# Altium project H7864.PrjPcb
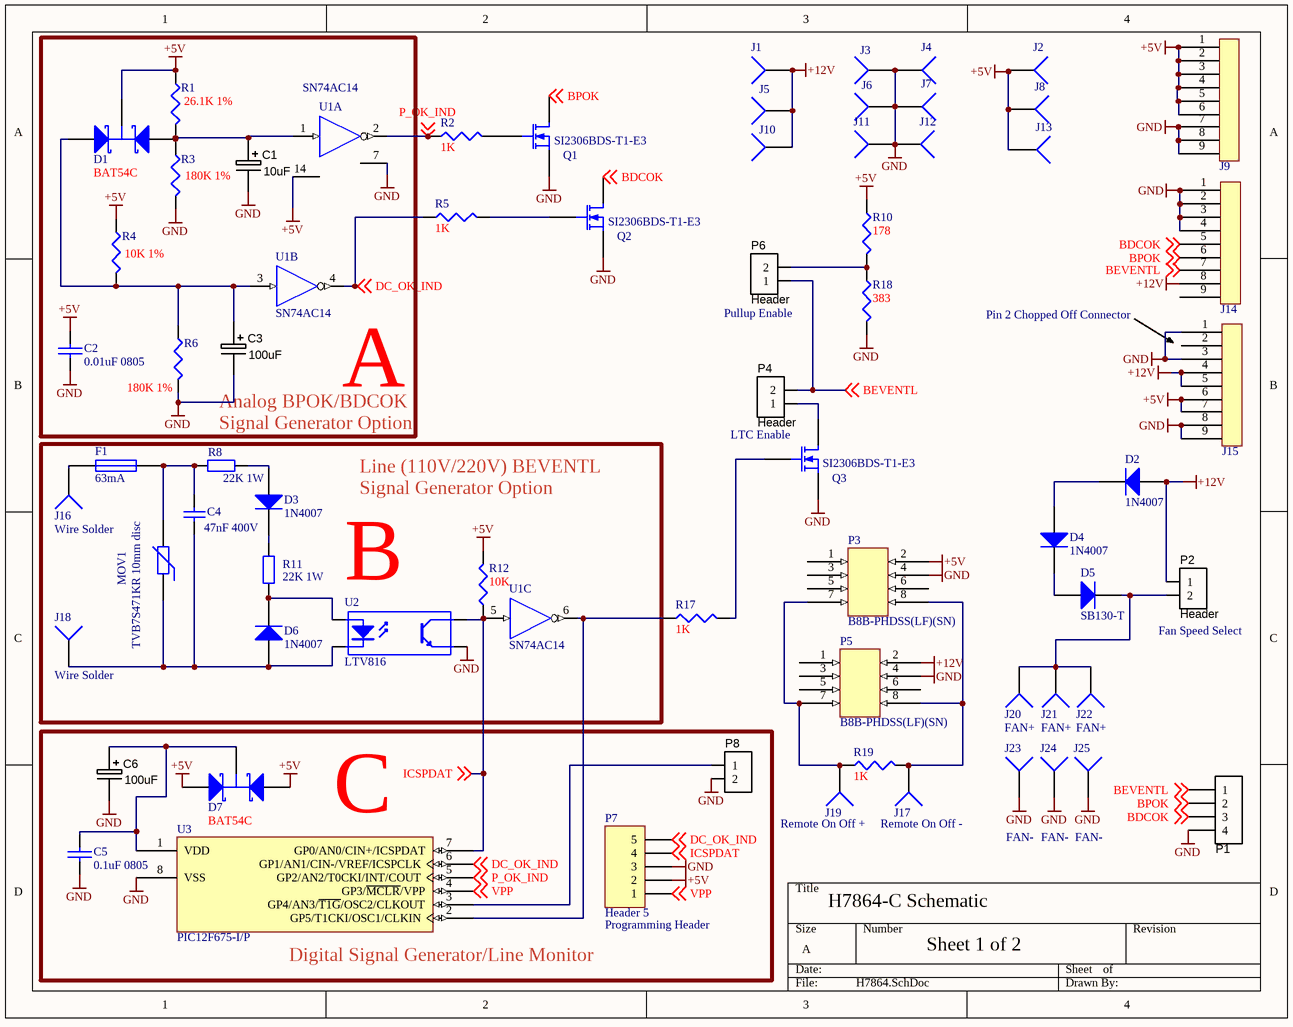
[diagram p0: H7864.SchDoc]
2 sheets, 77 parts. Net scope: global (net labels, ports and power ports of the same name join across sheets).
Board file: H7864-B-1.pcbdoc
Sheets:
  H7864.SchDoc
  Indicators.SchDoc

## Sheet H7864.SchDoc
size A

### Parts
C1  10uF  [CAPMP3216X180N]
C2  value 0.01uF 0805  [C0805-S]  (hidden comment: VJ0805Y103JXAPW1BC)
C3  100uF  [CAPMP3216X180N]
C4  value 47nF 400V  [MKP-3381-15]
C5  value 0.1uF 0805  [C0805-S]  (hidden comment: VJ0805Y103JXAPW1BC)
C6  100uF  [CAPMP3216X180N]
D1  BAT54C  [SOT23]
D2  value 1N4007  [DO-204AL]
D3  value 1N4007  [DO-204AL]
D4  value 1N4007  [DO-204AL]
D5  value SB130-T  [DO-204AL]
D6  value 1N4007  [DO-204AL]
D7  BAT54C  [SOT23]
F1  63mA  [FUSE HOLDER 656]
J1  Wire Solder  [TP-THT-MULTI]  (value not drawn)  (no BOM)
J2  Wire Solder  [TP-THT-MULTI]  (value not drawn)  (no BOM)
J3  Wire Solder  [TP-THT-MULTI]  (value not drawn)  (no BOM)
J4  Wire Solder  [TP-THT-MULTI]  (value not drawn)  (no BOM)
J5  Wire Solder  [TP-THT-MULTI]  (value not drawn)  (no BOM)
J6  Wire Solder  [TP-THT-MULTI]  (value not drawn)  (no BOM)
J7  Wire Solder  [TP-THT-MULTI]  (value not drawn)  (no BOM)
J8  Wire Solder  [TP-THT-MULTI]  (value not drawn)  (no BOM)
J9  1-640385-9  [MTA156-9]  (value not drawn)
J10  Wire Solder  [TP-THT-MULTI]  (value not drawn)  (no BOM)
J11  Wire Solder  [TP-THT-MULTI]  (value not drawn)  (no BOM)
J12  Wire Solder  [TP-THT-MULTI]  (value not drawn)  (no BOM)
J13  Wire Solder  [TP-THT-MULTI]  (value not drawn)  (no BOM)
J14  1-640385-9  [MTA156-9]  (value not drawn)
J15  1-640385-9  [MTA156-9]  (value not drawn)
J16  Wire Solder  [TP-THT-MULTI]
J17  Remote On Off -  [TP-THT-MULTI]
J18  Wire Solder  [TP-THT-MULTI]
J19  Remote On Off +  [TP-THT-MULTI]
J20  FAN+  [TP-THT-MULTI]  (no BOM)
J21  FAN+  [TP-THT-MULTI]  (no BOM)
J22  FAN+  [TP-THT-MULTI]  (no BOM)
J23  FAN-  [TP-THT-MULTI]  (no BOM)
J24  FAN-  [TP-THT-MULTI]  (no BOM)
J25  FAN-  [TP-THT-MULTI]  (no BOM)
MOV1  TVB7S471KR 10mm disc  [TVR1010]
P1  Programmer  [HDR1X4_2.54mmp]  (value not drawn)  (no BOM)
P2  Header  [HDR_1x2_Offset]
P3  B8B-PHDSS(LF)(SN)  [B8B-PHDSS]
P4  Header  [HDR_1x2_Offset]
P5  B8B-PHDSS(LF)(SN)  [B8B-PHDSS]
P6  Header  [HDR_1x2_Offset]
P7  Header 5  [HDR1X5]  (no BOM)
P8  Header  [HDR_1x2_Offset]  (value not drawn)
Q1  SI2306BDS-T1-E3  [SOT23-3]
Q2  SI2306BDS-T1-E3  [SOT23-3]
Q3  SI2306BDS-T1-E3  [SOT23-3]
R1  26.1K 1%  [2012[0805]]
R2  value 1K  [2012[0805]]  (hidden comment: CRCW080547K0FKEA)
R3  180K 1%  [2012[0805]]
R4  value 10K 1%  [2012[0805]]
R5  value 1K  [2012[0805]]  (hidden comment: CRCW080547K0FKEA)
R6  180K 1%  [2012[0805]]
R8  value 22K 1W  [RESTH_AXIAL_MRA-05]
R10  value 178  [2012[0805]]  (hidden comment: CRCW080547K0FKEA)
R11  value 22K 1W  [RESTH_AXIAL_MRA-05]
R12  value 10K  [2012[0805]]  (hidden comment: CRCW080547K0FKEA)
R17  value 1K  [2012[0805]]  (hidden comment: CRCW080547K0FKEA)
R18  value 383  [2012[0805]]  (hidden comment: CRCW080547K0FKEA)
R19  value 1K  [2012[0805]]  (hidden comment: CRCW080547K0FKEA)
U1  SN74AC14  [J014C]  (parts A,B,C of 6)
U2  LTV816  [DIP-4]
U3  PIC12F675-I/P  [DIP8-300]

### Blocks framed on the sheet
Programming Header: C5 C6 D7 P7 P8 U3

### Nets
+5V: C2.2 D1.3(K) D7.1(A1) D7.2(A2) J2.1 J8.1 J9.1 J9.2 J9.3 J9.4 J9.5 J9.6 J13.1 J15.6 J15.7 P3.2 P7.2 R1.1 R4.1 R10.1 R12.2 U1.14(VCC)
+12V: D2.1(A) J1.1 J5.1 J10.1 J14.8 J15.4 J15.5 P2.1 P5.2
GND: C1.2 C2.1 C3.2 C5.1 C6.2 J3.1 J4.1 J6.1 J7.1 J9.7 J9.8 J9.9 J11.1 J12.1 J14.1 J14.2 J14.3 J14.4 J15.1 J15.3 J15.8 J15.9 J23.1 J24.1 J25.1 P1.4 P3.4 P5.4 P7.3 P8.2 Q1.2(S) Q2.2(S) Q3.2(S) R3.2 R6.2 R18.2 U1.7(GND) U2.3(E) U3.8(VSS)
VCC: U1.14(VCC)
BDCOK: J14.5 P1.3 Q2.3(D) ; off-sheet BDCOK
BEVENTL: J14.7 P1.1 P4.2 P6.1 ; off-sheet BEVENTL
BPOK: J14.6 P1.2 Q1.3(D) ; off-sheet BPOK
DC_OK_IND: P7.5 R5.1 U1.4(Y) U3.6(GP1/AN1/CIN-/VREF/ICSPCLK) ; off-sheet DC_OK_IND
ICSPDAT: P7.4 R12.1 U1.5(A) U2.4(C) U3.7(GP0/AN0/CIN+/ICSPDAT) ; off-sheet ICSPDAT
P_OK_IND: R2.1 U1.2(Y) U3.5(GP2/AN2/T0CKI/INT/COUT) ; off-sheet P_OK_IND
VPP: P7.1 U3.4(GP3/~{MCLR}/VPP) ; off-sheet VPP
NetC1_1: C1.1 D1.2(A2) R1.2 R3.1 U1.1(A)
NetC3_1: C3.1 D1.1(A1) R4.2 R6.1 U1.3(A)
NetC4_1: C4.1 D6.1(A) J18.1 MOV1.1 U2.2(K)
NetC4_2: C4.2 F1.1 MOV1.2 R8.1
NetC5_2: C5.2 C6.1 D7.3(K) U3.1(VDD)
NetD2_2: D2.2(K) D4.1(A)
NetD3_1: D3.1(A) R8.2
NetD3_2: D3.2(K) R11.1
NetD4_2: D4.2(K) D5.1(A)
NetD5_2: D5.2(K) J20.1 J21.1 J22.1 P2.2
NetD6_2: D6.2(K) R11.2 U2.1(A)
NetF1_2: F1.2 J16.1
NetJ17_1: J17.1 P3.8 P5.8 R19.2
NetJ19_1: J19.1 P3.7 P5.7 R19.1
NetP4_1: P4.1 Q3.3(D)
NetP6_2: P6.2 R10.2 R18.1
NetP8_1: P8.1 U3.3(GP4/AN3/~{T1G}/OSC2/CLKOUT)
NetQ1_1: Q1.1(G) R2.2
NetQ2_1: Q2.1(G) R5.2
NetQ3_1: Q3.1(G) R17.2
NetR17_1: R17.1 U1.6(Y) U3.2(GP5/T1CKI/OSC1/CLKIN)

Not connected (* = marked no-connect by the designer): J14 9; J15 2; P3 1 3 5 6; P5 1 3 5 6

### Notes on the sheet
- (near P6) Pullup Enable
- Pin 2 Chopped Off Connector
- (near U1) A
- (near Q3) LTC Enable
- (near R8) Analog BPOK/BDCOK Signal Generator Option
- (near R12) Line (110V/220V) BEVENTL Signal Generator Option
- (near U2) B
- (near P2) Fan Speed Select
- (near U3) C
- H7864-C Schematic
- (near U3) Digital Signal Generator/Line Monitor
- Sheet 1 of 2

### Library data of the parts
C1 = CAPT_68u_3216_6V3: Capacitor SMD Tantalum 68uF 10% 6.3V EIA 3216-18; Manufacturer 1: Kemet; Manufacturer Part Number 1: T491A686K006AT; Manufacturer Size Code: A; Material: Solid Tantalum; ESR (Equivalent Series Resistance): 4.000 Ohm; SCDType: spec; P/N: TAJS106K006RNJ; Package / Case: 1206 (3216 Metric); Ratings: 6.3V; Tolerance: ±10%; Supplier 1: Digi-Key; Supplier Part Number 1: 399-4698-1-ND; Operating Temperature: -55°C ~ 125°C; Size / Dimension: 0.126" L x 0.063" W (3.20mm x 1.60mm); Height - Seated (Max): 0.071" (1.80mm); ComponentLink1URL: http://www.kemet.com/datasheets&T491A686K006AT; ComponentLink1Description: http://www.kemet.com/datasheets&T491A686K006AT; Value: 10uF
C2 = CAP: Capacitor; Manufacturer: Vishay; P/N: VJ0805Y103JXQPW1BC
C3 C6 = CAPT_68u_3216_6V3: Capacitor SMD Tantalum 68uF 10% 6.3V EIA 3216-18; Manufacturer 1: Kemet; Manufacturer Part Number 1: T491A686K006AT; Manufacturer Size Code: A; Material: Solid Tantalum; ESR (Equivalent Series Resistance): 4.000 Ohm; SCDType: spec; P/N: TCTAS0J107M8R; Package / Case: 1206 (3216 Metric); Ratings: 6.3V; Tolerance: ±10%; Supplier 1: Digi-Key; Supplier Part Number 1: 399-4698-1-ND; Operating Temperature: -55°C ~ 125°C; Size / Dimension: 0.126" L x 0.063" W (3.20mm x 1.60mm); Height - Seated (Max): 0.071" (1.80mm); ComponentLink1URL: http://www.kemet.com/datasheets&T491A686K006AT; ComponentLink1Description: http://www.kemet.com/datasheets&T491A686K006AT; Value: 100uF
C4 = Cap: Capacitor; P/N: B32642B6473J; Published: 8-Jun-2000; LatestRevisionDate: 17-Jul-2002; LatestRevisionNote: Re-released for DXP Platform.; PackageReference: RAD-0.3; Publisher: Altium Limited
C5 = CAP: Capacitor; Manufacturer: Vishay; P/N: VJ0805Y104KXQCW1BC
D1 D7 = BAT54C: Schottky Barrier Double Diode; Value: Dual Diode SOT23 Schottky; Published: 17-Sep-2003; LatestRevisionDate: 12-Dec-2006; LatestRevisionNote: IPC-7351 Footprint Added.; DatasheetVersion: 4-Mar-2002; PackageVersion: May-1999; PackageReference: SOT23; Publisher: Altium Limited; PackageDescription: 3-Pin SOT-23 Package 0.95 mm Pitch, 2.3 mm Lead Span; ComponentLink1Description: Manufacturer Link; ComponentLink1URL: http://www.semiconductors.philips.com/; ComponentLink2Description: Datasheet; ComponentLink2URL: http://www.semiconductors.philips.com/acrobat/datasheets/BAT54_SERIES_4.pdf; P/N: BAT54C
D2-D6 = Diode 1N4007: 1 Amp General Purpose Rectifier; Published: 8-Jun-2000; LatestRevisionDate: 17-Jul-2002; LatestRevisionNote: Re-released for DXP Platform.; DatasheetVersion: 1998; PackageVersion: Aug-1999; PackageReference: DO-41; Publisher: Altium Limited; PackageDescription: Diode, Axial; Body 5.2 x 2.7 mm (LxDia. max), Lead Dia. 0.86 mm (max); Code_JEDEC: DO-204-AL; ComponentLink1Description: Manufacturer Link; ComponentLink1URL: http://www.fairchildsemi.com/; ComponentLink2Description: Datasheet; ComponentLink2URL: http://www.fairchildsemi.com/ds/1N%2F1N4001.pdf
  D2-D4 D6: P/N: 1N4007
  D5: P/N: SB130-T
F1 = Fuse 1: Fuse Holder 65600001009  + cover 65900000009; Published: 8-Jun-2000; LatestRevisionDate: 17-Jul-2002; LatestRevisionNote: Re-released for DXP Platform.; PackageReference: PIN-W2/E2.8; Publisher: Altium Limited; P/N: 65600001009
J1-J8 J10-J13 J16-J18 J20-J25 = Socket: LatestRevisionDate: 17-Jul-2002; LatestRevisionNote: Re-released for DXP Platform.; Publisher: Altium Limited
J19 = Socket: P/N: 640388-2; LatestRevisionDate: 17-Jul-2002; LatestRevisionNote: Re-released for DXP Platform.; Publisher: Altium Limited
MOV1 = Res Varistor: Varistor (Voltage-Sensitive Resistor); Published: 24-Mar-1999; LatestRevisionDate: 29-May-2009; LatestRevisionNote: IPC-7351 Footprint Added.; PackageVersion: Mar-2003; PackageReference: 6-0805; Publisher: Altium Limited; PackageDescription: Chip Resistor 0805 Case Size; Code_IPC: RESC2012; P/N: TVB7S471KR
P1 = Header4P: Header 4-pin
P2 P4 P6 P8 = Header2P: Header, 2-pin; P/N: 61300211121
P7 = Header 5: Header, 5-Pin; LatestRevisionDate: 17-Jul-2002; LatestRevisionNote: Re-released for DXP Platform.; Publisher: Altium Limited
Q1-Q3 = MOSFET-N: N-Channel MOSFET; Manufacturer: Vishay; PackageDocument: 1995/1996; Alt P/N: DMN3404L-7; Published: 8-Jun-2000; LatestRevisionDate: 17-Jul-2002; LatestRevisionNote: Re-released for DXP Platform.; PackageReference: E3; Publisher: Altium Limited; P/N: SI2306BDS-T1-E3
R1 = Res3: Resistor; P/N: CRCW080526K1FKEA; Value: 26.1K 1%; Published: 8-Jun-2000; LatestRevisionDate: 04-Mar-2005; LatestRevisionNote: PCB Footprint replaced.; PackageReference: J1-0603; Publisher: Altium Limited
R2 R5 R17 R19 = Res3: Resistor; P/N: CRCW08051K00FKEAC; Published: 8-Jun-2000; LatestRevisionDate: 04-Mar-2005; LatestRevisionNote: PCB Footprint replaced.; PackageReference: J1-0603; Publisher: Altium Limited
R3 R6 = Res3: Resistor; P/N: CRCW0805180KFKEAC; Value: 180K 1%; Published: 8-Jun-2000; LatestRevisionDate: 04-Mar-2005; LatestRevisionNote: PCB Footprint replaced.; PackageReference: J1-0603; Publisher: Altium Limited
R4 R12 = Res3: Resistor; P/N: CRCW080510K0JNEAC; Published: 8-Jun-2000; LatestRevisionDate: 04-Mar-2005; LatestRevisionNote: PCB Footprint replaced.; PackageReference: J1-0603; Publisher: Altium Limited
R8 R11 = Res2: Resistor; P/N: MOS1CT528R223J; Published: 8-Jun-2000; LatestRevisionDate: 17-Jul-2002; LatestRevisionNote: Re-released for DXP Platform.; PackageReference: AXIAL-0.4; Publisher: Altium Limited; PackageDescription: Axial Device, Thru-Hole; 2 Leads; 0.4 in Pin Spacing
R10 = Res3: Resistor; P/N: CRCW0805178RFKEA; Published: 8-Jun-2000; LatestRevisionDate: 04-Mar-2005; LatestRevisionNote: PCB Footprint replaced.; PackageReference: J1-0603; Publisher: Altium Limited
R18 = Res3: Resistor; P/N: CRCW0805383RFKEA; Published: 8-Jun-2000; LatestRevisionDate: 04-Mar-2005; LatestRevisionNote: PCB Footprint replaced.; PackageReference: J1-0603; Publisher: Altium Limited
U1 = SN74AHCT14D: Hex Schmitt-Trigger Inverter; Published: 8-Jun-2000; LatestRevisionDate: 13-Apr-2006; LatestRevisionNote: IPC-7351 Footprint Added.; DatasheetVersion: Apr-1999; PackageVersion: Jan-1998; PackageReference: D014; Publisher: Altium Limited; PackageDescription: 14-Pin Small Outline Integrated Circuit 1.27 mm Pitch; Code_IPC: SOIC127P600-14; ComponentLink1Description: Manufacturer Link; ComponentLink1URL: http://www.ti.com/; ComponentLink2Description: Datasheet; ComponentLink2URL: http://www-s.ti.com/sc/ds/sn74ahct14.pdf; ComponentLink3Description: Packaging Specification; ComponentLink3URL: http://focus.ti.com/lit/ml/mpds177/mpds177.pdf; P/N: SN74AHCT14D
U2 = Optoisolator1: 4-Pin Phototransistor Optocoupler; Published: 24-Mar-1999; LatestRevisionDate: 04-Mar-2005; LatestRevisionNote: Sch pins 3 & 4 Swapped.; DatasheetVersion: Nov-2003; PackageReference: DIP-4; Publisher: Altium Limited; P/N: LTV816
U3 = PIC12F675-I/P: FLASH-Based 8-Bit CMOS Microcontroller, 10-Bit A/D, 8-Pin PDIP, Industrial Temperature; Note: Refer to data sheet (DS41190F) for details of supply voltage range under different conditions.; Published: 11-Oct-2004; LatestRevisionDate: 02-Dec-2009; LatestRevisionNote: Updated to datasheet revision revF, Sep-2009.; DatasheetVersion: revF, Sep-2009; PackageVersion: revBB, Aug-2009; PackageReference: PDIP300-P8; Publisher: Altium Limited; PackageDescription: 8-Lead Plastic Dual In-Line (P) - 300 mil Body [PDIP]; Supplier 1: Digi-Key; Supplier Part Number 1: PIC12F675-I/P-ND; Supplier 2: Farnell; Supplier Part Number 2: 9759018; Supplier 3: Farnell; Supplier Part Number 3: 1523921; Supplier 4: Farnell; Supplier Part Number 4: 4362640; Code_JEDEC: MS-001; ComponentLink1Description: Datasheet; ComponentLink1URL: http://ww1.microchip.com/downloads/en/DeviceDoc/41190F.pdf; ComponentLink2Description: Packaging Specification; ComponentLink2URL: http://www.microchip.com/stellent/groups/techpub_sg/documents/packagingspec/en012702.pdf; ComponentLink3Description: Microchip.com Home; ComponentLink3URL: http://www.microchip.com/
J9 J14 J15 = 1-640385-9: P/N: 640385-9
P3 P5 = B8B-PHDSS(LF)(SN): P/N: B8B-PHDSS(LF)(SN)

## Sheet Indicators.SchDoc
size A
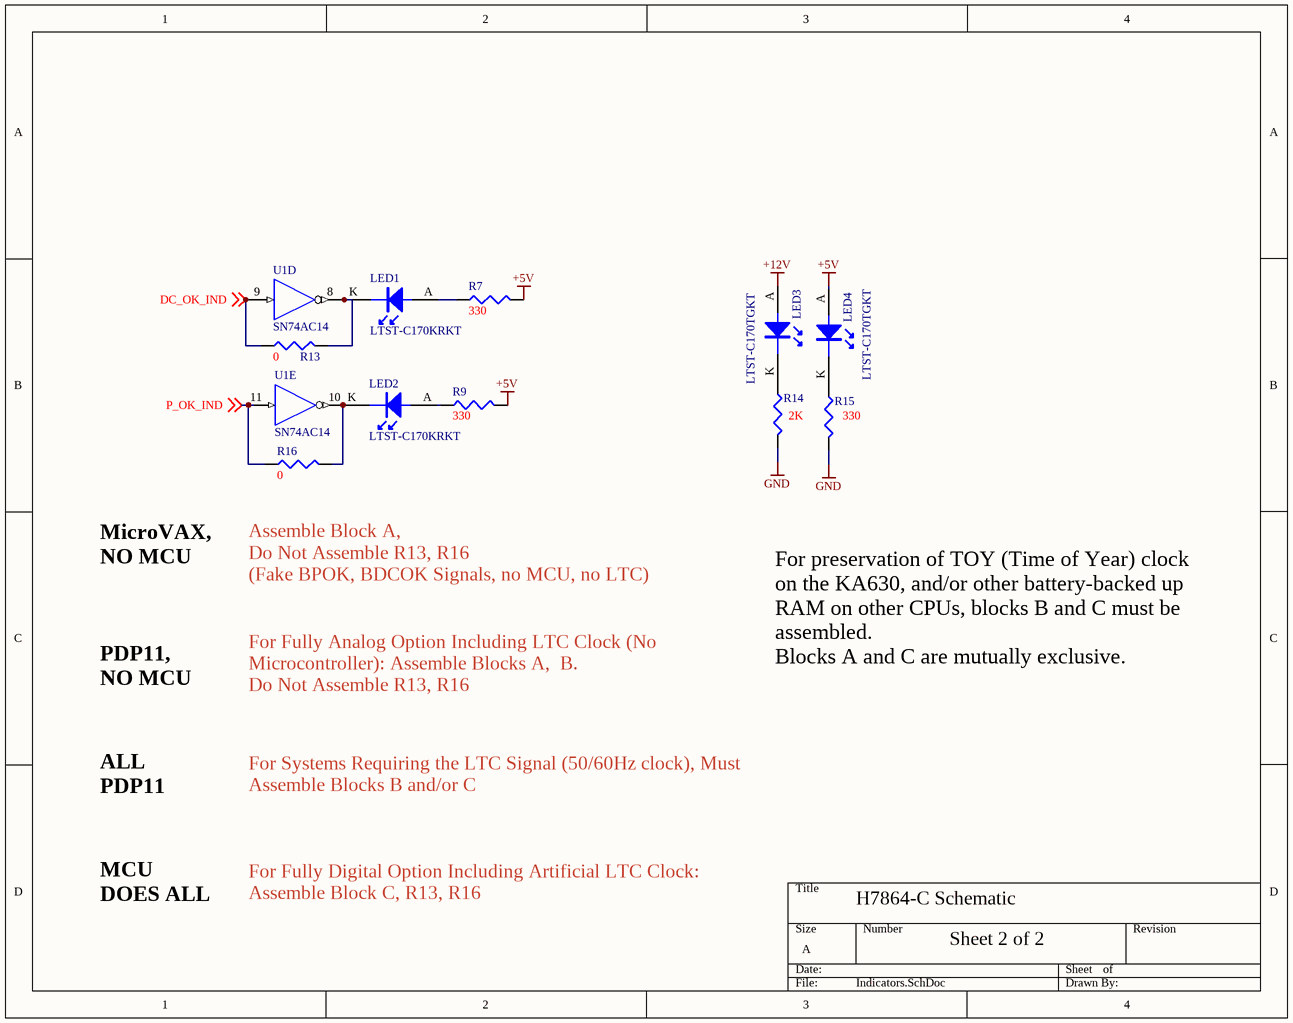
[diagram p1: Indicators.SchDoc]

### Parts
LED1  LTST-C170KRKT  [LTST-C170]
LED2  LTST-C170KRKT  [LTST-C170]
LED3  LTST-C170TGKT  [LTST-C170]
LED4  LTST-C170TGKT  [LTST-C170]
R7  330  [2012[0805]]
R9  330  [2012[0805]]
R13  value 0  [2012[0805]]  (hidden comment: CRCW080547K0FKEA)
R14  2K  [2012[0805]]
R15  330  [2012[0805]]
R16  value 0  [2012[0805]]  (hidden comment: CRCW080547K0FKEA)
U1  SN74AC14  [J014]  (parts D,E of 6)

### Nets
+5V: LED4.A R7.2 R9.2
+12V: LED3.A
GND: R14.2 R15.2 U1.7(GND)
VCC: U1.14(VCC)
DC_OK_IND: R13.1 U1.9(A) ; off-sheet DC_OK_IND
P_OK_IND: R16.1 U1.11(A) ; off-sheet P_OK_IND
NetLED1_A: LED1.A R7.1
NetLED1_K: LED1.K R13.2 U1.8(Y)
NetLED2_A: LED2.A R9.1
NetLED2_K: LED2.K R16.2 U1.10(Y)
NetLED3_K: LED3.K R14.1
NetLED4_K: LED4.K R15.1

### Notes on the sheet
- MicroVAX,
  NO MCU
- Assemble Block A,
  Do Not Assemble R13, R16
  (Fake BPOK, BDCOK Signals, no MCU, no LTC)
- PDP11,
  NO MCU
- For Fully Analog Option Including LTC Clock (No Microcontroller): Assemble Blocks A,  B.
  Do Not Assemble R13, R16
- For preservation of TOY (Time of Year) clock on the KA630, and/or other battery-backed up RAM on other CPUs, blocks B and C must be assembled.
  Blocks A and C are mutually exclusive.
- ALL
  PDP11
- For Systems Requiring the LTC Signal (50/60Hz clock), Must Assemble Blocks B and/or C
- MCU
  DOES ALL
- For Fully Digital Option Including Artificial LTC Clock:
  Assemble Block C, R13, R16
- H7864-C Schematic
- Sheet 2 of 2

### Library data of the parts
LED1 LED2 = LED: Value: EL-17-21SURC/S530-A2/TR8; P/N: LTST-C170KRKT
LED3 LED4 = LED: Value: EL-17-21SURC/S530-A2/TR8; P/N: LTST-C170KRKT
R7 R9 R15 = Res3: Resistor; P/N: CRCW0805330RFKEB; Value: 330; Published: 8-Jun-2000; LatestRevisionDate: 04-Mar-2005; LatestRevisionNote: PCB Footprint replaced.; PackageReference: J1-0603; Publisher: Altium Limited
R13 R16 = Res3: Resistor; P/N: CRCW08050000Z0EC; Published: 8-Jun-2000; LatestRevisionDate: 04-Mar-2005; LatestRevisionNote: PCB Footprint replaced.; PackageReference: J1-0603; Publisher: Altium Limited
R14 = Res3: Resistor; P/N: CRCW08052K00FKEAHP; Value: 2K; Published: 8-Jun-2000; LatestRevisionDate: 04-Mar-2005; LatestRevisionNote: PCB Footprint replaced.; PackageReference: J1-0603; Publisher: Altium Limited
U1 = SN74AHCT14D: Hex Schmitt-Trigger Inverter; Published: 8-Jun-2000; LatestRevisionDate: 13-Apr-2006; LatestRevisionNote: IPC-7351 Footprint Added.; DatasheetVersion: Apr-1999; PackageVersion: Jan-1998; PackageReference: D014; Publisher: Altium Limited; PackageDescription: 14-Pin Small Outline Integrated Circuit 1.27 mm Pitch; Code_IPC: SOIC127P600-14; ComponentLink1Description: Manufacturer Link; ComponentLink1URL: http://www.ti.com/; ComponentLink2Description: Datasheet; ComponentLink2URL: http://www-s.ti.com/sc/ds/sn74ahct14.pdf; ComponentLink3Description: Packaging Specification; ComponentLink3URL: http://focus.ti.com/lit/ml/mpds177/mpds177.pdf; P/N: SN74AHCT14D

## Nets that join several sheets
+5V: H7864 (22 pins), Indicators (LED4.A R7.2 R9.2)
+12V: H7864 (9 pins), Indicators (LED3.A)
GND: H7864 (39 pins), Indicators (R14.2 R15.2 U1.7)
VCC: H7864 (U1.14), Indicators (U1.14)
DC_OK_IND: H7864 (P7.5 R5.1 U1.4 U3.6), Indicators (R13.1 U1.9)
P_OK_IND: H7864 (R2.1 U1.2 U3.5), Indicators (R16.1 U1.11)

## Assembly variants
Analog Signals: not fitted C5 D7 P1 P7 R13 R16 U3
Digital Signals: not fitted P1 P7 U1